# EasyEDA Pro project LisaFPGA Rev 2 EasyEDA Project.epro, schematic LisaFPGA Schematic, sheets 6 to 7 of 8

## Sheets
6 Audio/Video: Create Date: 2025-10-28; Page Name: Audio/Video; Update Date: 2026-01-07
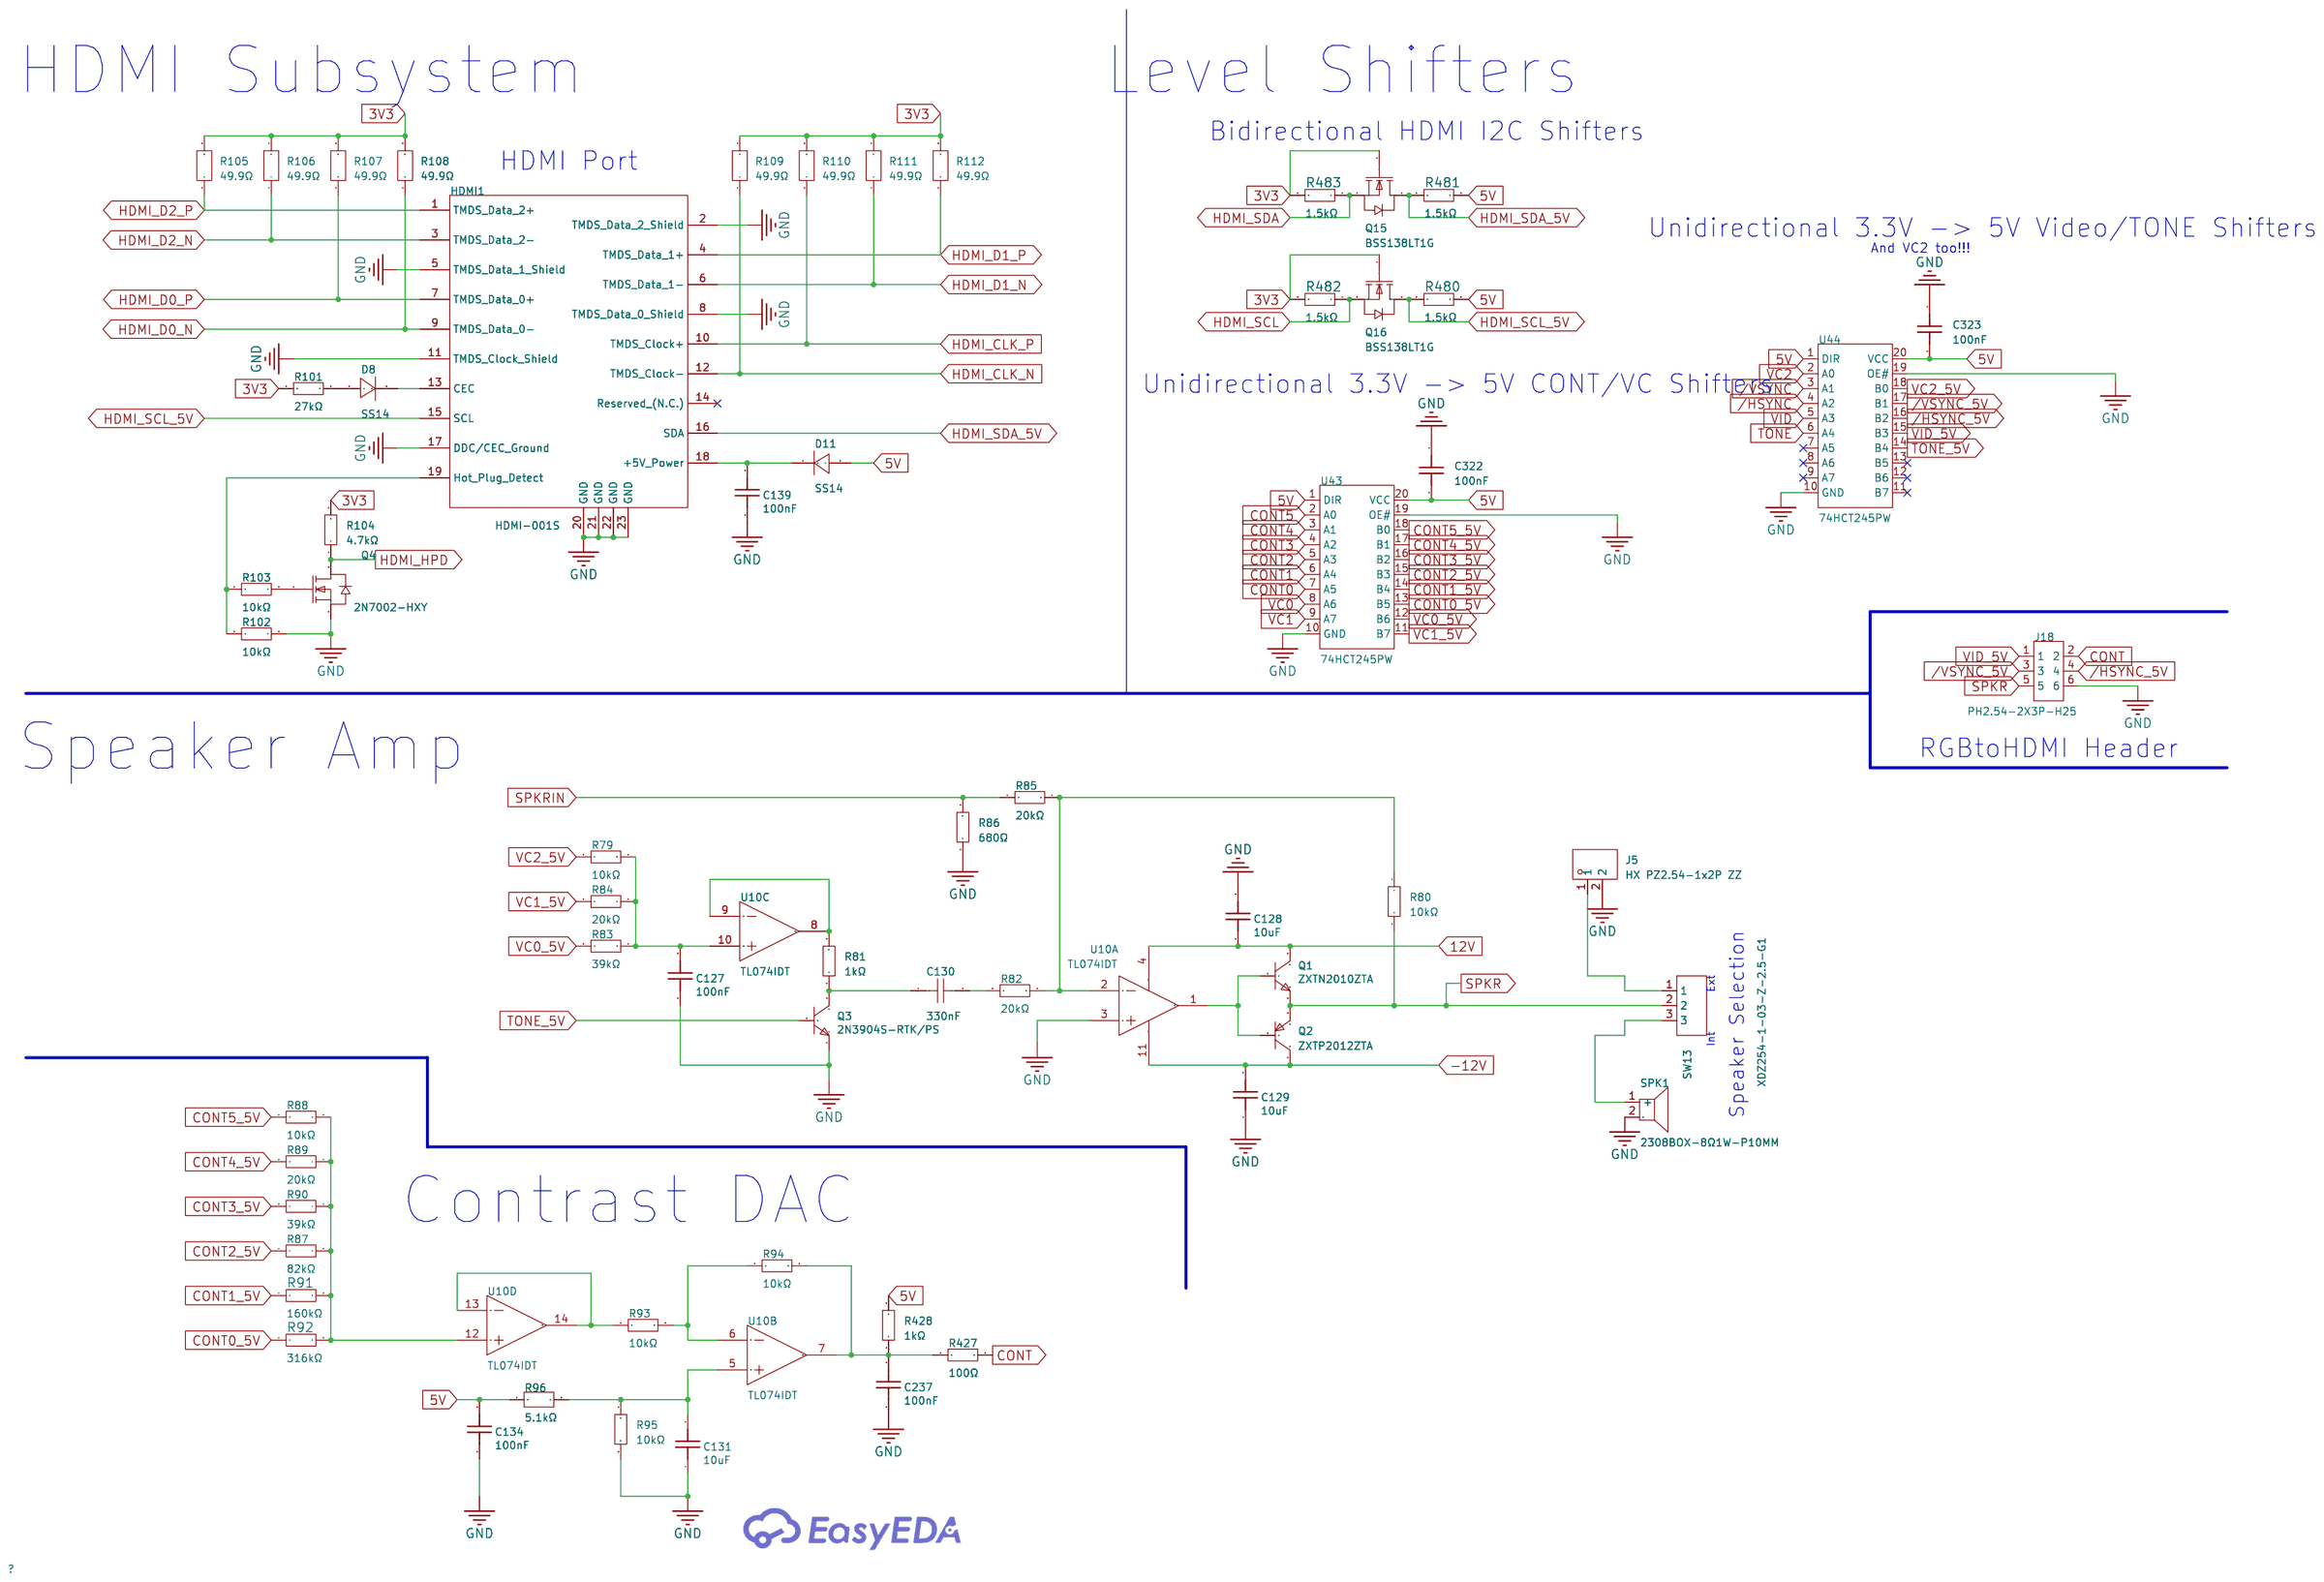
[diagram p6: Audio/Video]
7 Misc. I/O: Create Date: 2025-10-28; Page Name: Misc. I/O; Update Date: 2026-02-01
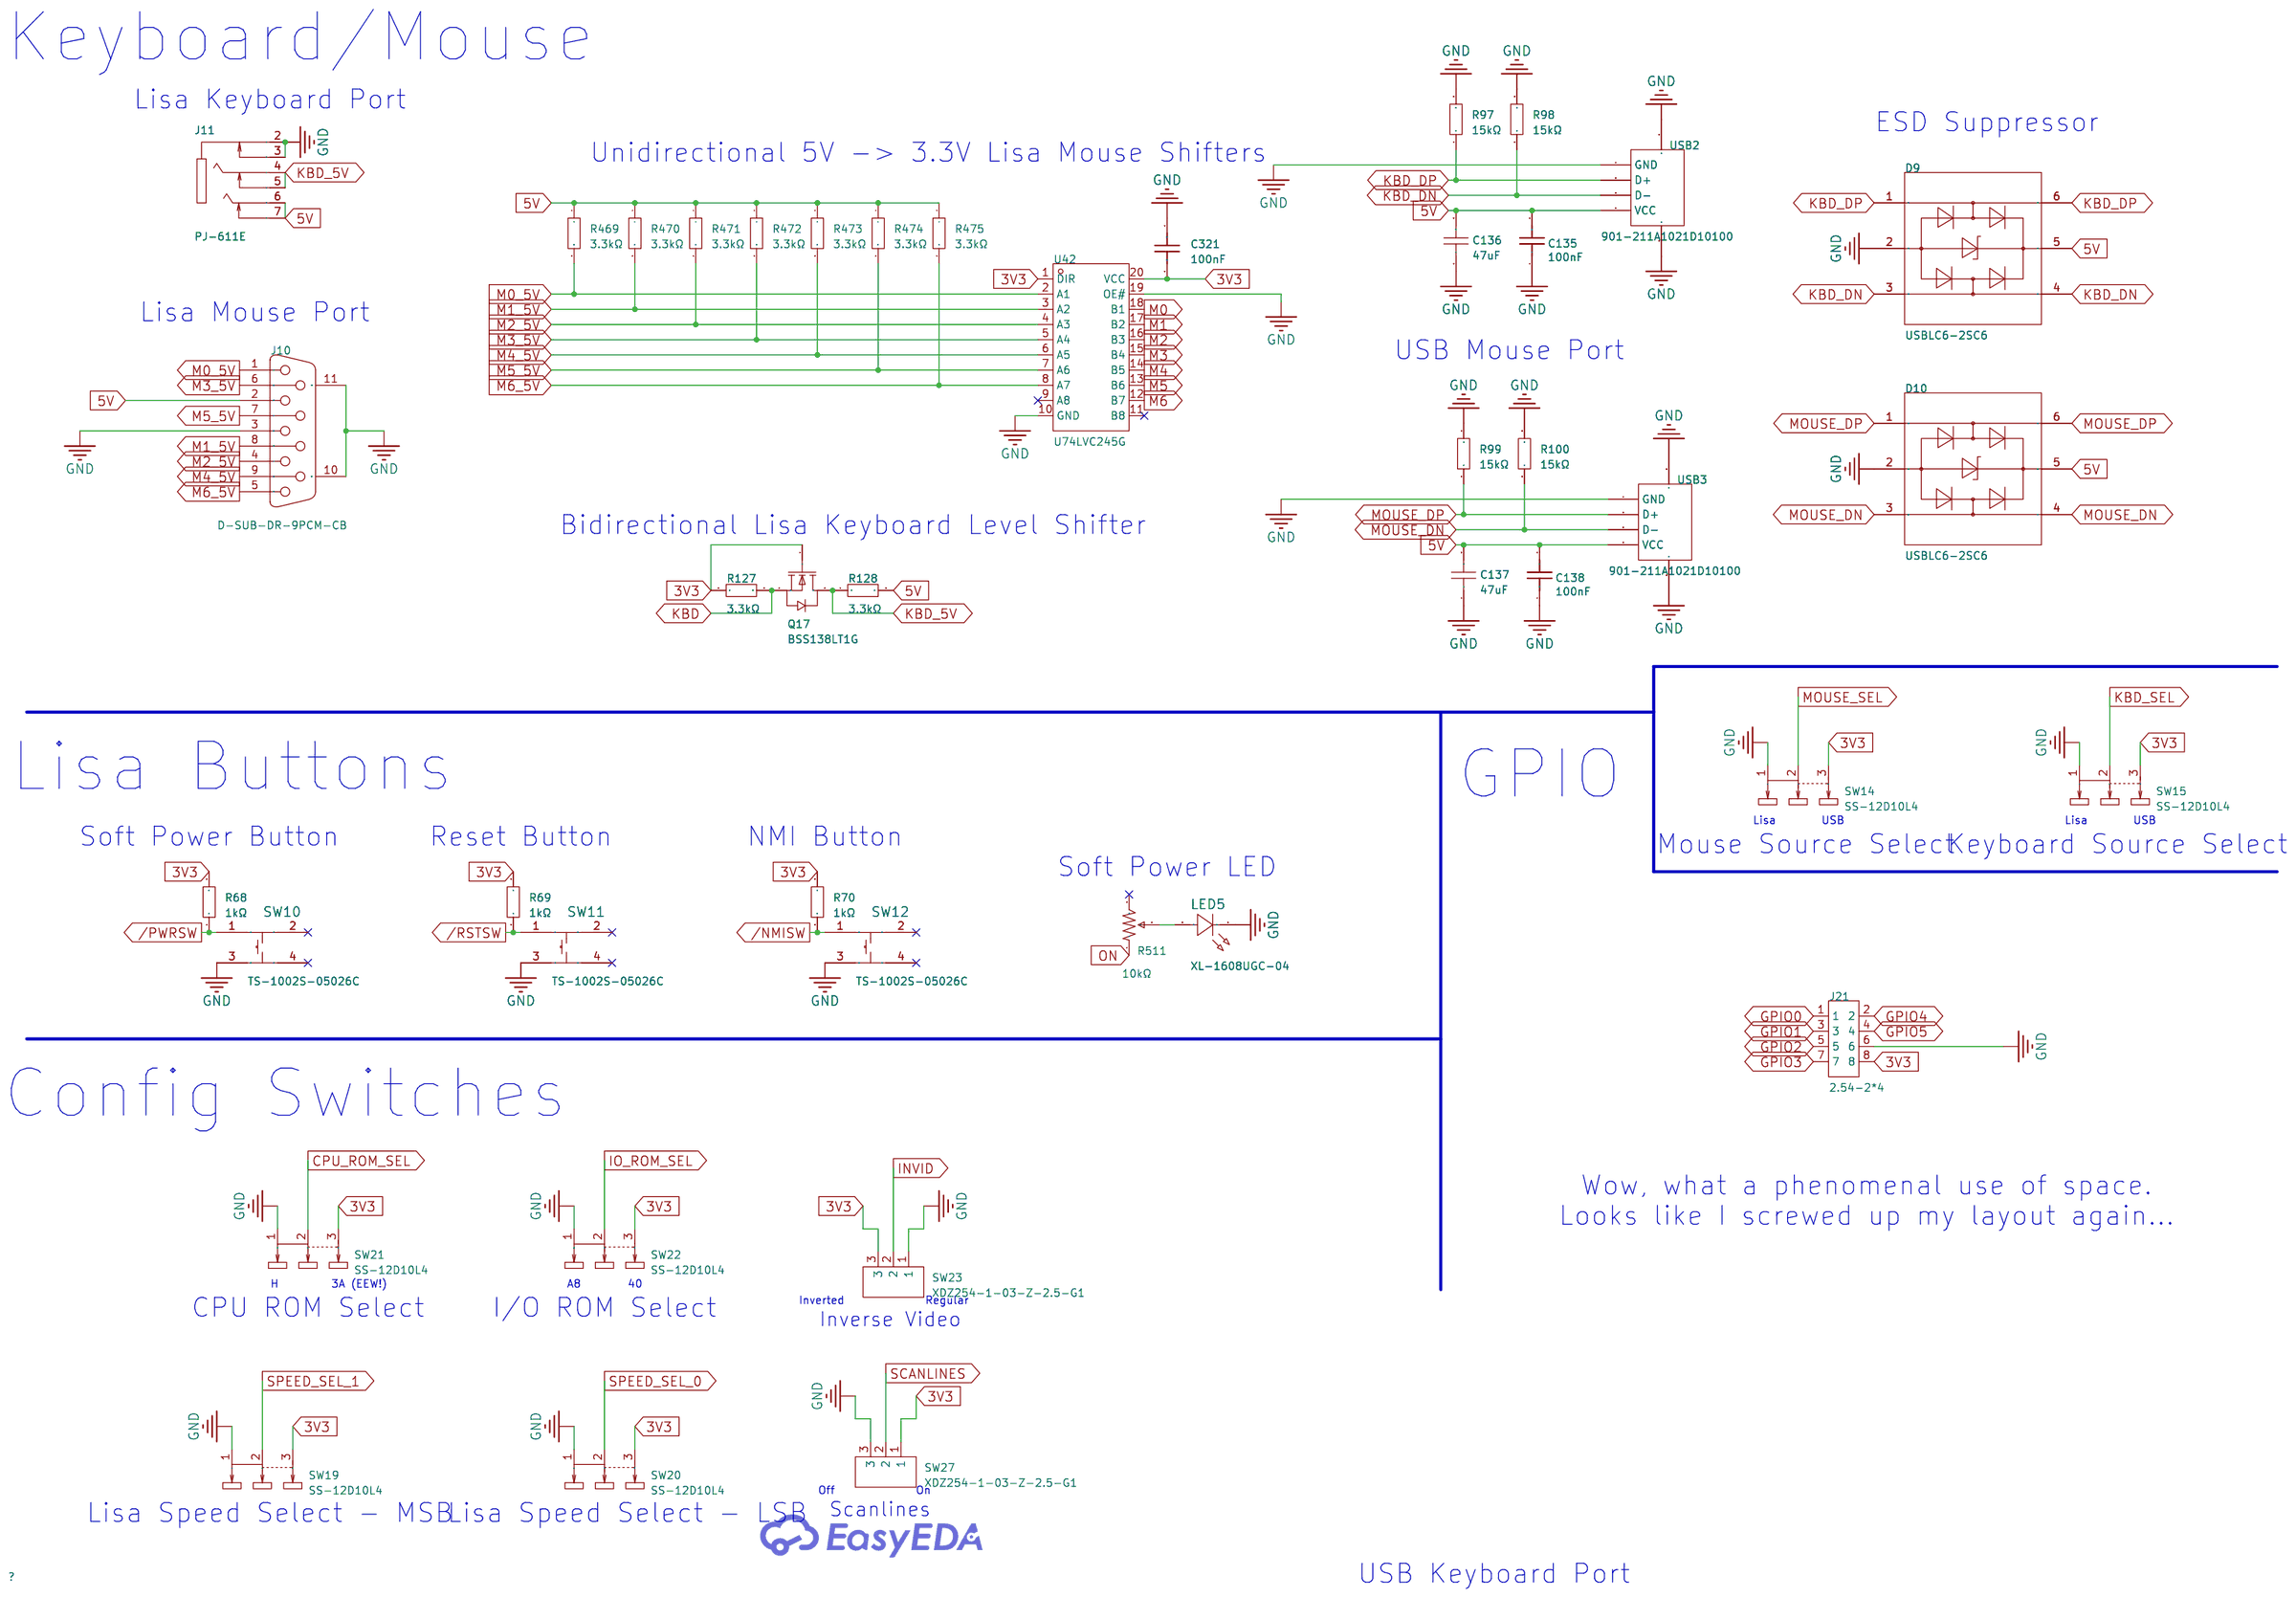
[diagram p7: Misc. I/O]

## Parts
sheet Audio/Video
C127  100nF  [C0402]
C128  10uF  [C0603]
C129  10uF  [C0603]
C130  330nF  [C0402]
C131  10uF  [C0603]
C134  100nF  [C0402]
C139  100nF  [C0402]
C237  100nF  [C0402]
C322  100nF  [C0402]
C323  100nF  [C0402]
D8  SS14  [SMA_L4.3-W2.6-LS5.0-RD]
D11  SS14  [SMA_L4.3-W2.6-LS5.0-RD]
HDMI1  HDMI-001S  [HDMI-SMD_HDMI-001S]
J5  HX PZ2.54-1x2P ZZ  [HDR-TH_2P-P2.54-V-M-3]
J18  PH2.54-2X3P-H25  [HDR-TH_6P-P2.54-V-M-R2-C3-S2.54-1]
Q1  ZXTN2010ZTA  [SOT-89-3_L4.5-W2.5-P1.50-LS4.2-TR]
Q2  ZXTP2012ZTA  [SOT-89-3_L4.5-W2.5-P1.50-LS4.2-TR]
Q3  2N3904S-RTK/PS  [SOT-23-3_L2.9-W1.3-P1.90-LS2.4-TR]
Q4  2N7002-HXY  [SOT-23-3_L2.9-W1.3-P1.90-LS2.4-BR]
Q15  BSS138LT1G  [SOT-23-3_L2.9-W1.6-P1.90-LS2.8-BR]
Q16  BSS138LT1G  [SOT-23-3_L2.9-W1.6-P1.90-LS2.8-BR]
R79  10kΩ  [R0402]
R80  10kΩ  [R0402]
R81  1kΩ  [R0402]
R82  20kΩ  [R0402]
R83  39kΩ  [R0402]
R84  20kΩ  [R0402]
R85  20kΩ  [R0402]
R86  680Ω  [R0402]
R87  82kΩ  [R0402]
R88  10kΩ  [R0402]
R89  20kΩ  [R0402]
R90  39kΩ  [R0402]
R91  160kΩ  [R0402]
R92  316kΩ  [R0402]
R93  10kΩ  [R0402]
R94  10kΩ  [R0402]
R95  10kΩ  [R0402]
R96  5.1kΩ  [R0603]
R101  27kΩ  [R0402]
R102  10kΩ  [R0402]
R103  10kΩ  [R0402]
R104  4.7kΩ  [R0402]
R105  49.9Ω  [R0402]
R106  49.9Ω  [R0402]
R107  49.9Ω  [R0402]
R108  49.9Ω  [R0402]
R109  49.9Ω  [R0402]
R110  49.9Ω  [R0402]
R111  49.9Ω  [R0402]
R112  49.9Ω  [R0402]
R427  100Ω  [R0402]
R428  1kΩ  [R0402]
R480  1.5kΩ  [R0402]
R481  1.5kΩ  [R0402]
R482  1.5kΩ  [R0402]
R483  1.5kΩ  [R0402]
SPK1  2308BOX-8Ω1W-P10MM  [BUZ-TH_BD23.0-P10.0-D0.0.8-FD]
SW13  XDZ254-1-03-Z-2.5-G1  [HDR-TH_3P-P2.54-V-M-1]
U10  TL074IDT  [SOIC-14_L8.7-W3.9-P1.27-LS6.0-BL]  (sections 1,2,3,4)
U43  74HCT245PW  [TSSOP-20_L6.5-W4.4-P0.65-LS6.4-BL]
U44  74HCT245PW  [TSSOP-20_L6.5-W4.4-P0.65-LS6.4-BL]
sheet Misc. I/O
C135  100nF  [C0402]
C136  47uF  [C1210]
C137  47uF  [C1210]
C138  100nF  [C0402]
C321  100nF  [C0402]
D9  USBLC6-2SC6  [SOT-23-6_L2.9-W1.6-P0.95-LS2.8-BL]
D10  USBLC6-2SC6  [SOT-23-6_L2.9-W1.6-P0.95-LS2.8-BL]
J10  D-SUB-DR-9PCM-CB  [DB9-TH_D-SUB-DR-9PCM-CB]
J11  PJ-611E  [AUDIO-TH_PJ-611E]
J21  2.54-2*4  [HDR-TH_8P-P2.54-V-F-R2-C4-S2.54]
LED5  XL-1608UGC-04  [LED0603-RD_GREEN]
Q17  BSS138LT1G  [SOT-23-3_L2.9-W1.6-P1.90-LS2.8-BR]
R68  1kΩ  [R0402]
R69  1kΩ  [R0402]
R70  1kΩ  [R0402]
R97  15kΩ  [R0402]
R98  15kΩ  [R0402]
R99  15kΩ  [R0402]
R100  15kΩ  [R0402]
R127  3.3kΩ  [R0402]
R128  3.3kΩ  [R0402]
R469  3.3kΩ  [R0402]
R470  3.3kΩ  [R0402]
R471  3.3kΩ  [R0402]
R472  3.3kΩ  [R0402]
R473  3.3kΩ  [R0402]
R474  3.3kΩ  [R0402]
R475  3.3kΩ  [R0402]
R511  10kΩ  [RES-ADJ-SMD_3P-L3.0-W3.8-P1.75-BR]
SW10  TS-1002S-05026C  [KEY-SMD_4P-L6.0-W6.0-P4.50-LS9.0]
SW11  TS-1002S-05026C  [KEY-SMD_4P-L6.0-W6.0-P4.50-LS9.0]
SW12  TS-1002S-05026C  [KEY-SMD_4P-L6.0-W6.0-P4.50-LS9.0]
SW14  SS-12D10L4  [SW-TH_SS-12D10L3]
SW15  SS-12D10L4  [SW-TH_SS-12D10L3]
SW19  SS-12D10L4  [SW-TH_SS-12D10L3]
SW20  SS-12D10L4  [SW-TH_SS-12D10L3]
SW21  SS-12D10L4  [SW-TH_SS-12D10L3]
SW22  SS-12D10L4  [SW-TH_SS-12D10L3]
SW23  XDZ254-1-03-Z-2.5-G1  [HDR-TH_3P-P2.54-V-M-1]
SW27  XDZ254-1-03-Z-2.5-G1  [HDR-TH_3P-P2.54-V-M-1]
U42  U74LVC245G  [TSSOP-20_L6.5-W4.4-P0.65-LS6.4-BL]
USB2  901-211A1021D10100  [USB-A-TH_USB-M-1_C2346]
USB3  901-211A1021D10100  [USB-A-TH_USB-M-1_C2346]

## Library data of the parts
C127 C134 C135 C138 C139 C237 C321-C323 = 100nF: Supplier: LCSC; Supplier Part: C343042; Manufacturer: TDK; Manufacturer Part: CGA2B3X7R1H104KT0Y0F; JLCPCB Part Class: Extended Part; nameAlias: Value; Contributor: LCSC; spicePre: C; spiceSymbolName: CGA2B3X7R1H104KT0Y0F
C128 C129 C131 = 10uF: Supplier: LCSC; Supplier Part: C2936601; Manufacturer: YAGEO(国巨); Manufacturer Part: CC0603KRX5R7BB106; JLCPCB Part Class: Extended Part; nameAlias: Value; Contributor: lcsc; spicePre: C; spiceSymbolName: CC0603KRX5R7BB106
C130 = TCC0402X5R334K250AT: Capacitance:330nF Tolerance:±10% Tolerance:±10% Voltage Rating:25V Temperature Coefficient:X5R; LCSC Part Name: 330nF ±10% 25V; Supplier Part: C5448882; Manufacturer: CCTC(三环); Supplier Footprint: 0402; JLCPCB Part Class: Extended Part; Datasheet: https://item.szlcsc.com/datasheet/TCC0402X5R334K250AT/6350845.html; Supplier: LCSC; Tolerance: ±10%; Voltage Rating: 25V; Temperature Coefficient: X5R
D8 D11 = SS14_C2837270: Diode Configuration:- Voltage - Forward(Vf@If):550mV@1A Voltage - DC Reverse(Vr):40V Current - Rectified:1A Reverse Leakage Current (Ir):500uA@40V Operating Junction Temperature Range:-55℃~+125℃ Operating Junction Temperature Range:-55℃~+125℃; LCSC Part Name: 电压:40V 电流:1A; Supplier Part: C2837270; Manufacturer: JSMSEMI(杰盛微); Supplier Footprint: SMA(DO-214AC); JLCPCB Part Class: Extended Part; Datasheet: https://item.szlcsc.com/datasheet/SS14/3007842.html; Supplier: LCSC; Voltage - Forward(Vf@If): 550mV@1A; Voltage - DC Reverse(Vr): 40V; Current - Rectified: 1A; Reverse Leakage Current (Ir): 500uA@40V; Operating Junction Temperature Range: -55℃~+125℃
HDMI1 = HDMI-001S: Connector Type:HDMI-A Gender:Female Number of Pins:19P Mounting Type:Surface Mount, Right Angle Current Rating:- Voltage Rating:- Operating Temperature:- Operating Temperature:-; Supplier Part: C720616; Manufacturer: XUNPU(讯普); Supplier Footprint: SMD; JLCPCB Part Class: Extended Part; Datasheet: https://item.szlcsc.com/datasheet/HDMI-001S/763623.html; Supplier: LCSC; Connector Type: HDMI-A; Gender: Female; Number of Pins: 19P; Mounting Type: Surface Mount, Right Angle
J5 = HX PZ2.54-1x2P ZZ: Pin Structure:1x2P Pitch:2.54mm Row Spacing:- Circluar Pins/Square Pins:Pin Header Mounting Type:Through Hole Number of Rows:1 Number of Pins:2P Current Rating:3A Voltage Rating (Max):1kV Length of Mating Pin:6mm Insulation Height:2.5mm Length of End Conn; LCSC Part Name: 1x2P 间距:2.54mm 方针 直插; Supplier Part: C32713268; Manufacturer: hanxia(韩下); Supplier Footprint: 插件,P=2.54mm; JLCPCB Part Class: Extended Part; Datasheet: https://item.szlcsc.com/datasheet/HX%2520PZ2.54-1x2P%2520ZZ/34444548.html; Supplier: LCSC; Pin Structure: 1x2P; Pitch: 2.54mm; Circluar Pins/Square Pins: Pin Header; Mounting Type: Through Hole; Number of Rows: 1; Number of Pins: 2P; Current Rating: 3A; Voltage Rating (Max): 1kV; Length of Mating Pin: 6mm; Insulation Height: 2.5mm; Length of End Connection Pin: 3mm; Contact Material: Brass; Contact Plating: Gold; Operating Temperature: -40℃~+105℃; Color: Black
J18 = PH2.54-2X3P-H25: Pin Structure:2x3P Pitch:2.54mm Row Spacing:2.54mm Circluar Pins/Square Pins:Pin Header Mounting Type:Through Hole Number of Rows:2 Number of Pins:6P Current Rating:3A Voltage Rating (Max):- Length of Mating Pin:6mm Insulation Height:2.5mm Length of End C; LCSC Part Name: 2x3P 间距:2.54mm 方针 直插; Supplier Part: C42431837; Manufacturer: JXTCONN(聚兴泰); Supplier Footprint: 插件,P=2.54mm; JLCPCB Part Class: Extended Part; Datasheet: https://item.szlcsc.com/datasheet/PH2.54-2X3P-H25/44458967.html; Supplier: LCSC; Pin Structure: 2x3P; Pitch: 2.54mm; Row Spacing: 2.54mm; Circluar Pins/Square Pins: Pin Header; Mounting Type: Through Hole; Number of Rows: 2; Number of Pins: 6P; Current Rating: 3A; Length of Mating Pin: 6mm; Insulation Height: 2.5mm; Length of End Connection Pin: 3mm; Contact Material: Brass; Contact Plating: Gold; Operating Temperature: -40℃~+105℃; Color: Black
Q1 = ZXTN2010ZTA: Transistor Type: Collector Current (Ic): Collector-Emitter Breakdown Voltage (Vceo): Power Dissipation (Pd): DC Current Gain (hFE@Ic,Vce):55@5A,1V DC Current Gain (hFE@Ic,Vce):55@5A,1V Transition Frequency (fT):130MHz Collector Cut-Off Current (Icbo):50nA; LCSC Part Name: NPN 电流:5A 耐压:60V; Supplier Part: C122575; Manufacturer: DIODES(美台); Supplier Footprint: SOT-89-3; JLCPCB Part Class: Extended Part; Datasheet: https://atta.szlcsc.com/upload/public/pdf/source/20170721/C122575_1500619339552834112.pdf; Supplier: LCSC; DC Current Gain (hFE@Ic,Vce): 55@5A,1V; Transition Frequency (fT): 130MHz; Collector Cut-Off Current (Icbo): 50nA; Collector-Emitter Saturation Voltage (VCE(sat)@Ic,Ib): 65mV@1A,50mA; Operating Temperature: -55℃~+150℃
Q2 = ZXTP2012ZTA: type:PNP Current - Collector(Ic):4.3A Collector - Emitter Voltage VCEO:60V Pd - Power Dissipation:1.5W DC Current Gain:45@5A,1V DC Current Gain:45@5A,1V Transition frequency(fT):120MHz Current - Collector Cutoff:20nA Vce Saturation(VCE(sat)):65mV Operatin; LCSC Part Name: PNP 电流:4.3A 电压:60V; Supplier Part: C122574; Manufacturer: DIODES(美台); Supplier Footprint: SOT-89; JLCPCB Part Class: Extended Part; Datasheet: https://item.szlcsc.com/datasheet/ZXTP2012ZTA/123843.html; Supplier: LCSC; type: PNP; Current - Collector(Ic): 4.3A; Collector - Emitter Voltage VCEO: 60V; Pd - Power Dissipation: 1.5W; DC Current Gain: 45@5A,1V; Transition frequency(fT): 120MHz; Current - Collector Cutoff: 20nA; Vce Saturation(VCE(sat)): 65mV; Operating Temperature: -55℃~+150℃
Q3 = 2N3904S-RTK/PS_C18536: type:NPN Current - Collector(Ic):200mA Collector - Emitter Voltage VCEO:40V Pd - Power Dissipation:350mW DC Current Gain:100@10mA,1V DC Current Gain:100@10mA,1V Transition frequency(fT):300MHz Current - Collector Cutoff:- Vce Saturation(VCE(sat)):300mV Op; LCSC Part Name: NPN 电流:200mA 电压:40V; Supplier Part: C18536; Manufacturer: KEC; Supplier Footprint: SOT-23; JLCPCB Part Class: Extended Part; Datasheet: https://item.szlcsc.com/datasheet/2N3904S-RTK%252FPS/19236.html; Supplier: LCSC; type: NPN; Current - Collector(Ic): 200mA; Collector - Emitter Voltage VCEO: 40V; Pd - Power Dissipation: 350mW; DC Current Gain: 100@10mA,1V; Transition frequency(fT): 300MHz; Vce Saturation(VCE(sat)): 300mV
Q4 = 2N7002-HXY: Number:1 N-Channel Drain to Source Voltage:60V Current - Continuous Drain(Id):300mA RDS(on):2Ω@10V,0.1A Pd - Power Dissipation:350mW Gate Threshold Voltage (Vgs(th)):1.9V Gate Charge(Qg):3nC@4.5V Input Capacitance(Ciss):50pF Reverse Transfer Capacitance (; LCSC Part Name: 1个N沟道 耐压:60V 电流:0.3A; Supplier Part: C4748728; Manufacturer: HXY MOSFET(华轩阳电子); Supplier Footprint: SOT-23; JLCPCB Part Class: Extended Part; Datasheet: https://item.szlcsc.com/datasheet/2N7002-HXY/5320771.html; Supplier: LCSC; Number: 1 N-Channel; Drain to Source Voltage: 60V; Current - Continuous Drain(Id): 300mA; RDS(on): 2Ω@10V,0.1A; Pd - Power Dissipation: 350mW; Gate Threshold Voltage (Vgs(th)): 1.9V; Gate Charge(Qg): 3nC@4.5V; Input Capacitance(Ciss): 50pF; Reverse Transfer Capacitance (Crss@Vds): 4.2pF; Operating Temperature: -55℃~+150℃
Q15-Q17 = BSS138LT1G: Number:1 N-Channel Drain to Source Voltage:50V Current - Continuous Drain(Id):200mA RDS(on):5.6Ω@2.75V Pd - Power Dissipation:225mW Gate Threshold Voltage (Vgs(th)):500mV Input Capacitance(Ciss):50pF@25V Reverse Transfer Capacitance (Crss@Vds):5pF@25V Ope; LCSC Part Name: 1个N沟道 耐压:50V 电流:200mA; Supplier Part: C82045; Manufacturer: onsemi(安森美); Supplier Footprint: SOT-23; JLCPCB Part Class: Extended Part; Datasheet: https://item.szlcsc.com/datasheet/BSS138LT1G/83200.html; Supplier: LCSC; Number: 1 N-Channel; Drain to Source Voltage: 50V; Current - Continuous Drain(Id): 200mA; RDS(on): 5.6Ω@2.75V; Pd - Power Dissipation: 225mW; Gate Threshold Voltage (Vgs(th)): 500mV; Input Capacitance(Ciss): 50pF@25V; Reverse Transfer Capacitance (Crss@Vds): 5pF@25V; Operating Temperature: -55℃~+150℃
R79 R80 R88 R93-R95 R102 R103 = RC0402FR-0710KL: Type:Thick Film Resistor Resistance:10kΩ Tolerance:±1% Tolerance:±1% Power(Watts):62.5mW Voltage-Supply(Max):50V Temperature Coefficient:±100ppm/℃ Temperature Coefficient:±100ppm/℃ Operating Temperature:-55℃~+155℃ Operating Temperature:-55℃~+155℃; LCSC Part Name: 厚膜电阻 10kΩ ±1% 62.5mW; Supplier Part: C60490; Manufacturer: YAGEO(国巨); Supplier Footprint: 0402; JLCPCB Part Class: Extended Part; Datasheet: https://item.szlcsc.com/datasheet/RC0402FR-0710KL/61542.html; Supplier: LCSC; Type: Thick Film Resistor; Tolerance: ±1%; Power(Watts): 62.5mW; Voltage-Supply(Max): 50V; Temperature Coefficient: ±100ppm/℃; Operating Temperature: -55℃~+155℃
R68-R70 R81 R428 = RC0402FR-071KL: Type:Thick Film Resistors Resistance: Tolerance:±1% Tolerance:±1% Power(Watts): Overload Voltage (Max): Temperature Coefficient:±100ppm/℃ Temperature Coefficient:±100ppm/℃ Operating Temperature Range:-55℃~+155℃ Operating Temperature Range:-55℃~+155℃; LCSC Part Name: 厚膜电阻 1kΩ ±1% 62.5mW; Supplier Part: C106235; Manufacturer: YAGEO(国巨); Supplier Footprint: 0402; JLCPCB Part Class: Extended Part; Datasheet: https://atta.szlcsc.com/upload/public/pdf/source/20180927/C295883_E8D83085EA81BD7DE0B2B681138C15EE.pdf; Supplier: LCSC; Type: Thick Film Resistors; Tolerance: ±1%; Temperature Coefficient: ±100ppm/℃; Operating Temperature Range: -55℃~+155℃
R82 R84 R85 R89 = RC0402FR-0720KL: Type:Thick Film Resistor Resistance:20kΩ Tolerance:±1% Tolerance:±1% Power(Watts):62.5mW Voltage-Supply(Max):50V Temperature Coefficient:±100ppm/℃ Temperature Coefficient:±100ppm/℃ Operating Temperature:-55℃~+155℃ Operating Temperature:-55℃~+155℃; LCSC Part Name: 厚膜电阻 20kΩ ±1% 62.5mW; Supplier Part: C93942; Manufacturer: YAGEO(国巨); Supplier Footprint: 0402; JLCPCB Part Class: Extended Part; Datasheet: https://atta.szlcsc.com/upload/public/pdf/source/20250610/89E4D743C004A82A45145C7A2CC3A578.pdf; Supplier: LCSC; Type: Thick Film Resistor; Tolerance: ±1%; Power(Watts): 62.5mW; Voltage-Supply(Max): 50V; Temperature Coefficient: ±100ppm/℃; Operating Temperature: -55℃~+155℃
R83 R90 = 0402WGF3902TCE: Type:Thick Film Resistor Resistance:39kΩ Tolerance:±1% Tolerance:±1% Power(Watts):62.5mW Voltage-Supply(Max):50V Temperature Coefficient:±100ppm/℃ Temperature Coefficient:±100ppm/℃ Operating Temperature:-55℃~+155℃ Operating Temperature:-55℃~+155℃; LCSC Part Name: 39kΩ ±1% 62.5mW 厚膜电阻; Supplier Part: C25783; Manufacturer: UNI-ROYAL(厚声); Supplier Footprint: 0402; JLCPCB Part Class: Extended Part; Datasheet: https://item.szlcsc.com/datasheet/0402WGF3902TCE/26526.html; Supplier: LCSC; Type: Thick Film Resistor; Tolerance: ±1%; Power(Watts): 62.5mW; Voltage-Supply(Max): 50V; Temperature Coefficient: ±100ppm/℃; Operating Temperature: -55℃~+155℃
R86 = 0402WGF6800TCE: Type:Thick Film Resistor Resistance:680Ω Tolerance:±1% Tolerance:±1% Power(Watts):62.5mW Voltage-Supply(Max):50V Temperature Coefficient:±100ppm/℃ Temperature Coefficient:±100ppm/℃ Operating Temperature:-55℃~+155℃ Operating Temperature:-55℃~+155℃; LCSC Part Name: 680Ω ±1% 62.5mW 厚膜电阻; Supplier Part: C25130; Manufacturer: UNI-ROYAL(厚声); Supplier Footprint: 0402; JLCPCB Part Class: Extended Part; Datasheet: https://item.szlcsc.com/datasheet/0402WGF6800TCE/25873.html; Supplier: LCSC; Type: Thick Film Resistor; Tolerance: ±1%; Power(Watts): 62.5mW; Voltage-Supply(Max): 50V; Temperature Coefficient: ±100ppm/℃; Operating Temperature: -55℃~+155℃
R87 = RC0402FR-0782KL: Type:Thick Film Resistor Resistance:82kΩ Tolerance:±1% Tolerance:±1% Power(Watts):62.5mW Voltage-Supply(Max):50V Temperature Coefficient:±100ppm/℃ Temperature Coefficient:±100ppm/℃ Operating Temperature:-55℃~+155℃ Operating Temperature:-55℃~+155℃; LCSC Part Name: 厚膜电阻 82kΩ ±1% 62.5mW; Supplier Part: C137932; Manufacturer: YAGEO(国巨); Supplier Footprint: 0402; JLCPCB Part Class: Extended Part; Datasheet: https://atta.szlcsc.com/upload/public/pdf/source/20250610/89E4D743C004A82A45145C7A2CC3A578.pdf; Supplier: LCSC; Type: Thick Film Resistor; Tolerance: ±1%; Power(Watts): 62.5mW; Voltage-Supply(Max): 50V; Temperature Coefficient: ±100ppm/℃; Operating Temperature: -55℃~+155℃
R91 = 0402WGF1603TCE: Type:Thick Film Resistors Resistance:160kΩ Tolerance:±1% Tolerance:±1% Power(Watts): Overload Voltage (Max): Temperature Coefficient:±100ppm/℃ Temperature Coefficient:±100ppm/℃ Operating Temperature Range:-55℃~+155℃ Operating Temperature Range:-55℃~+155℃; LCSC Part Name: 160kΩ ±1% 62.5mW 厚膜电阻; Supplier Part: C25757; Manufacturer: UNI-ROYAL(厚声); Supplier Footprint: 0402; JLCPCB Part Class: Extended Part; Datasheet: https://atta.szlcsc.com/upload/public/pdf/source/20200306/C422600_1E6D84923E4A46A82E41ADD87F860B5C.pdf; Supplier: LCSC; Type: Thick Film Resistors; Tolerance: ±1%; Temperature Coefficient: ±100ppm/℃; Operating Temperature Range: -55℃~+155℃
R92 = 0402WGF3163TCE: Type:Thick Film Resistor Resistance:316kΩ Tolerance:±1% Tolerance:±1% Power(Watts):62.5mW Voltage-Supply(Max):50V Temperature Coefficient:±100ppm/℃ Temperature Coefficient:±100ppm/℃ Operating Temperature:-55℃~+155℃ Operating Temperature:-55℃~+155℃; LCSC Part Name: 316kΩ ±1% 62.5mW 厚膜电阻; Supplier Part: C25777; Manufacturer: UNI-ROYAL(厚声); Supplier Footprint: 0402; JLCPCB Part Class: Extended Part; Datasheet: https://item.szlcsc.com/datasheet/0402WGF3163TCE/26520.html; Supplier: LCSC; Type: Thick Film Resistor; Tolerance: ±1%; Power(Watts): 62.5mW; Voltage-Supply(Max): 50V; Temperature Coefficient: ±100ppm/℃; Operating Temperature: -55℃~+155℃
R96 = FRC0603F5101TS: Type:Thick Film Resistor Resistance:5.1kΩ Tolerance:±1% Tolerance:±1% Power(Watts):100mW Voltage-Supply(Max):75V Temperature Coefficient:±100ppm/℃ Temperature Coefficient:±100ppm/℃ Operating Temperature:-55℃~+155℃ Operating Temperature:-55℃~+155℃; LCSC Part Name: 5.1kΩ ±1% 100mW 厚膜电阻; Supplier Part: C2907044; Manufacturer: FOJAN(富捷); Supplier Footprint: 0603; JLCPCB Part Class: Extended Part; Supplier: LCSC; Type: Thick Film Resistor; Tolerance: ±1%; Power(Watts): 100mW; Voltage-Supply(Max): 75V; Temperature Coefficient: ±100ppm/℃; Operating Temperature: -55℃~+155℃
R101 = 0402WGF2702TCE: Type:Thick Film Resistor Resistance:27kΩ Tolerance:±1% Tolerance:±1% Power(Watts):62.5mW Voltage-Supply(Max):50V Temperature Coefficient:±100ppm/℃ Temperature Coefficient:±100ppm/℃ Operating Temperature:-55℃~+155℃ Operating Temperature:-55℃~+155℃; LCSC Part Name: 27kΩ ±1% 62.5mW 厚膜电阻; Supplier Part: C25771; Manufacturer: UNI-ROYAL(厚声); Supplier Footprint: 0402; JLCPCB Part Class: Extended Part; Datasheet: https://item.szlcsc.com/datasheet/0402WGF2702TCE/26514.html; Supplier: LCSC; Type: Thick Film Resistor; Tolerance: ±1%; Power(Watts): 62.5mW; Voltage-Supply(Max): 50V; Temperature Coefficient: ±100ppm/℃; Operating Temperature: -55℃~+155℃
R104 = RC0402FR-074K7L: Type:Thick Film Resistor Resistance:4.7kΩ Tolerance:±1% Tolerance:±1% Power(Watts):62.5mW Voltage-Supply(Max):50V Temperature Coefficient:±100ppm/℃ Temperature Coefficient:±100ppm/℃ Operating Temperature:-55℃~+155℃ Operating Temperature:-55℃~+155℃; LCSC Part Name: 厚膜电阻 4.7kΩ ±1% 62.5mW; Supplier Part: C105871; Manufacturer: YAGEO(国巨); Supplier Footprint: 0402; JLCPCB Part Class: Extended Part; Datasheet: https://item.szlcsc.com/datasheet/RC0402FR-074K7L/107086.html; Supplier: LCSC; Type: Thick Film Resistor; Tolerance: ±1%; Power(Watts): 62.5mW; Voltage-Supply(Max): 50V; Temperature Coefficient: ±100ppm/℃; Operating Temperature: -55℃~+155℃
R105-R112 = FRC0402F49R9TS: Type:Thick Film Resistor Resistance:49.9Ω Tolerance:±1% Tolerance:±1% Power(Watts):62.5mW Voltage-Supply(Max):50V Temperature Coefficient:±100ppm/℃ Temperature Coefficient:±100ppm/℃ Operating Temperature:-55℃~+155℃ Operating Temperature:-55℃~+155℃; LCSC Part Name: 49.9Ω ±1% 62.5mW 厚膜电阻; Supplier Part: C2933103; Manufacturer: FOJAN(富捷); Supplier Footprint: 0402; JLCPCB Part Class: Extended Part; Supplier: LCSC; Type: Thick Film Resistor; Tolerance: ±1%; Power(Watts): 62.5mW; Voltage-Supply(Max): 50V; Temperature Coefficient: ±100ppm/℃; Operating Temperature: -55℃~+155℃
R427 = RC0402FR-07100RL: Type:Thick Film Resistor Resistance:100Ω Tolerance:±1% Tolerance:±1% Power(Watts):62.5mW Voltage-Supply(Max):50V Temperature Coefficient:±100ppm/℃ Temperature Coefficient:±100ppm/℃ Operating Temperature:-55℃~+155℃ Operating Temperature:-55℃~+155℃; LCSC Part Name: 厚膜电阻 100Ω ±1% 62.5mW; Supplier Part: C106232; Manufacturer: YAGEO(国巨); Supplier Footprint: 0402; JLCPCB Part Class: Extended Part; Datasheet: https://item.szlcsc.com/datasheet/RC0402FR-07100RL/107447.html; Supplier: LCSC; Type: Thick Film Resistor; Tolerance: ±1%; Power(Watts): 62.5mW; Voltage-Supply(Max): 50V; Temperature Coefficient: ±100ppm/℃; Operating Temperature: -55℃~+155℃
R480-R483 = 0402WGF1501TCE: Type:Thick Film Resistors Resistance:1.5kΩ Tolerance:±1% Tolerance:±1% Power(Watts): Overload Voltage (Max): Temperature Coefficient:±100ppm/℃ Temperature Coefficient:±100ppm/℃ Operating Temperature Range:-55℃~+155℃ Operating Temperature Range:-55℃~+155℃; LCSC Part Name: 1.5kΩ ±1% 62.5mW 厚膜电阻; Supplier Part: C25867; Manufacturer: UNI-ROYAL(厚声); Supplier Footprint: 0402; JLCPCB Part Class: Basic Part; Datasheet: https://atta.szlcsc.com/upload/public/pdf/source/20200306/C422600_1E6D84923E4A46A82E41ADD87F860B5C.pdf; Supplier: LCSC; Type: Thick Film Resistors; Tolerance: ±1%; Temperature Coefficient: ±100ppm/℃; Operating Temperature Range: -55℃~+155℃
SPK1 = 2308BOX-8Ω1W-P10MM: Frequency Range:0Hz~20kHz Frequency Range:0Hz~20kHz Impedance:8Ω Resonant Frequency:- Total Harmonic Distortion(THD):5% Total Harmonic Distortion(THD):5% Rated Power:1W Sound Pressure Level(SPL):- Diameter(φD):23mm Height:- Operating Temperature:- Operati; LCSC Part Name: 腔体喇叭; Supplier Part: C49247024; Manufacturer: XHXDZ(兴华鑫); JLCPCB Part Class: Extended Part; Datasheet: https://item.szlcsc.com/datasheet/2308BOX-8%25CE%25A91W-P10MM/51674993.html; Supplier: LCSC; Frequency Range: 0Hz~20kHz; Impedance: 8Ω; Total Harmonic Distortion(THD): 5%; Rated Power: 1W; Diameter(φD): 23mm
SW13 SW23 SW27 = XDZ254-1-03-Z-2.5-G1: Pin Structure:1x3P Pitch:2.54mm Circluar Pins/Square Pins:Pin Header Mounting Type:Through Hole Number of Rows:1 Number of Pins:3P Current Rating:3A Length of Mating Pin:6mm Insulation Height:2.5mm Length of End Connection Pin:3mm Operating Temperature:-4; LCSC Part Name: 1x3P 间距:2.54mm 方针 直插; Supplier Part: C18905844; Manufacturer: XUNDA(讯答); Supplier Footprint: 插件,P=2.54mm; JLCPCB Part Class: Extended Part; Datasheet: https://item.szlcsc.com/datasheet/XDZ254-1-03-Z-2.5-G1/20100548.html; Supplier: LCSC; Pin Structure: 1x3P; Pitch: 2.54mm; Circluar Pins/Square Pins: Pin Header; Mounting Type: Through Hole; Number of Rows: 1; Number of Pins: 3P; Current Rating: 3A; Length of Mating Pin: 6mm; Insulation Height: 2.5mm; Length of End Connection Pin: 3mm; Operating Temperature: -40℃~+105℃; Color: Black
U10 = TL074IDT: Number of Channels:QUAD Gain Bandwidth Product:3MHz Ib - Input Bias Current:20pA Vos - Input Offset Voltage:3mV Common Mode Rejection Ratio(CMRR):86dB Slew Rate:13V/us Voltage - Supply:6V~36V Voltage - Supply:6V~36V Quiescent Current per Amplifier:1.4mA R; LCSC Part Name: 低噪声JFET四通道运算放大器; Supplier Part: C107644; Manufacturer: ST(意法半导体); Supplier Footprint: SOIC-14; JLCPCB Part Class: Extended Part; Datasheet: https://item.szlcsc.com/datasheet/TL074IDT/108863.html; Supplier: LCSC; Number of Channels: QUAD; Gain Bandwidth Product: 3MHz; Ib - Input Bias Current: 20pA; Vos - Input Offset Voltage: 3mV; Common Mode Rejection Ratio(CMRR): 86dB; Slew Rate: 13V/us; Voltage - Supply: 6V~36V; Quiescent Current per Amplifier: 1.4mA; Input Offset Voltage Drift(Vos TC): 5uV/℃
U43 U44 = 74HCT245PW: Supplier Part: C52140501; Manufacturer: MDD(辰达半导体); Supplier Footprint: TSSOP-20L; JLCPCB Part Class: Extended Part; Datasheet: https://item.szlcsc.com/datasheet/74HCT245PW/54938180.html; Supplier: LCSC
C136 C137 = CS3225X7R476K160NRL: Capacitance:47uF Tolerance:±10% Tolerance:±10% Voltage Rating:16V Temperature Coefficient:X7R; LCSC Part Name: 47uF ±10% 16V; Supplier Part: C5440143; Manufacturer: SAMWHA(三和); Supplier Footprint: 1210; JLCPCB Part Class: Extended Part; Datasheet: https://atta.szlcsc.com/upload/public/pdf/source/20241120/90C342CED6A4517481676783052A38A7.pdf; Supplier: LCSC; Tolerance: ±10%; Voltage Rating: 16V; Temperature Coefficient: X7R
D9 D10 = USBLC6-2SC6_C7519: Polarity:Unidirectional Reverse Stand-Off Voltage (Vrwm):5.25V Clamping Voltage:17V Peak Pulse Current (Ipp):5A Voltage - Breakdown:6V Reverse Leakage Current (Ir):150nA Number of Channels:2 Operating Temperature:-40℃~+125℃ Operating Temperature:-40℃~+125; LCSC Part Name: 单向ESD; Supplier Part: C7519; Manufacturer: ST(意法半导体); Supplier Footprint: SOT-23-6L; JLCPCB Part Class: Extended Part; Datasheet: https://item.szlcsc.com/datasheet/USBLC6-2SC6/7996.html; Supplier: LCSC; Polarity: Unidirectional; Reverse Stand-Off Voltage (Vrwm): 5.25V; Clamping Voltage: 17V; Peak Pulse Current (Ipp): 5A; Voltage - Breakdown: 6V; Reverse Leakage Current (Ir): 150nA; Number of Channels: 2; Operating Temperature: -40℃~+125℃; level of protection: IEC 61000-4-2; Type: ESD; Junction Capacitance: 3.5pF
J10 = D-SUB-DR-9PCM-CB: Gender:Female Number of Pins:9P Mounting Type:Right Angle Number of Rows:2 Current Rating-Signal:3A Color:Black Operating Temperature:-50℃~+105℃ Operating Temperature:-50℃~+105℃; LCSC Part Name: 母 P数:9P; Supplier Part: C19077337; Manufacturer: XUNPU(讯普); Supplier Footprint: 弯插; JLCPCB Part Class: Extended Part; Datasheet: https://item.szlcsc.com/datasheet/D-SUB-DR-9PCM-CB/20275081.html; Supplier: LCSC; Gender: Female; Number of Pins: 9P; Mounting Type: Right Angle; Number of Rows: 2; Current Rating-Signal: 3A; Color: Black; Operating Temperature: -50℃~+105℃
J11 = PJ-611E: Connector Type:6.35mm Headphone Jack Current Rating:1A Voltage Rating (Max):50V Operating Temperature:-20℃~+70℃ Operating Temperature:-20℃~+70℃; LCSC Part Name: 三件套 6.35mm耳机座; Supplier Part: C309282; Manufacturer: HOOYA(皓宇电子); Supplier Footprint: 插件; JLCPCB Part Class: Extended Part; Datasheet: https://item.szlcsc.com/datasheet/PJ-611E/292943.html; Supplier: LCSC; Connector Type: 6.35mm Headphone Jack; Current Rating: 1A; Voltage Rating (Max): 50V; Operating Temperature: -20℃~+70℃
J21 = 2.54-2*4: Holes Structure:2x4P Pitch:2.54mm Row Spacing:2.54mm Circular Hole / Square Hole:Square Hole Mounting Type:Through Hole Number of Rows:2 Number of Positions:8P Current Rating:2.5A Voltage Rating (Max):- Holes Direction:Top Insulation Height:8.5mm Operatin; LCSC Part Name: 间距:2.54mm 2x4P 直插; Supplier Part: C2977588; Manufacturer: ZHOURI(洲日); Supplier Footprint: 插件,P=2.54mm; JLCPCB Part Class: Extended Part; Datasheet: https://item.szlcsc.com/datasheet/2.54-2*4/3388940.html; Supplier: LCSC; Holes Structure: 2x4P; Pitch: 2.54mm; Row Spacing: 2.54mm; Circular Hole / Square Hole: Square Hole; Mounting Type: Through Hole; Number of Rows: 2; Number of Positions: 8P; Current Rating: 2.5A; Holes Direction: Top; Insulation Height: 8.5mm; Operating Temperature: -40℃~+105℃
LED5 = XL-1608UGC-04: Lamp Holder Type:- Illumination Color:Emerald Green Voltage - Forward(Vf):3.3V Voltage - Forward(Vf):3.3V Power(Watts):70mW Forward Current:20mA Wavelength - Dominant:515nm~535nm Wavelength - Dominant:515nm~535nm Peak Wavelength:525nm Diode Configuration:; Supplier Part: C965804; Manufacturer: XINGLIGHT(成兴光); Supplier Footprint: 0603; JLCPCB Part Class: Extended Part; Datasheet: https://item.szlcsc.com/datasheet/XL-1608UGC-04/1051413.html; Supplier: LCSC; Illumination Color: Emerald Green; Voltage - Forward(Vf): 3.3V; Power(Watts): 70mW; Forward Current: 20mA; Wavelength - Dominant: 515nm~535nm; Peak Wavelength: 525nm; Diode Configuration: Discrete Diode; Lens Color: Water Clear; Luminous Intensity: 810mcd; Viewing Angle: 120°; Mounting Style: op View Mount
R97-R100 = RC0402FR-0715KL: Type:Thick Film Resistors Resistance: Tolerance:±1% Tolerance:±1% Power(Watts): Overload Voltage (Max): Temperature Coefficient:±100ppm/℃ Temperature Coefficient:±100ppm/℃ Operating Temperature Range:-55℃~+155℃ Operating Temperature Range:-55℃~+155℃; LCSC Part Name: 厚膜电阻 15kΩ ±1% 62.5mW; Supplier Part: C114761; Manufacturer: YAGEO(国巨); Supplier Footprint: 0402; JLCPCB Part Class: Extended Part; Datasheet: https://atta.szlcsc.com/upload/public/pdf/source/20180821/C275644_0D56F95EFF785E7D9A1FEF436B37DA78.pdf; Supplier: LCSC; Type: Thick Film Resistors; Tolerance: ±1%; Temperature Coefficient: ±100ppm/℃; Operating Temperature Range: -55℃~+155℃
R127 R128 R469-R475 = RC0402FR-073K3L: Type:Thick Film Resistor Resistance:3.3kΩ Tolerance:±1% Tolerance:±1% Power(Watts):62.5mW Voltage-Supply(Max):50V Temperature Coefficient:±100ppm/℃ Temperature Coefficient:±100ppm/℃ Operating Temperature:-55℃~+155℃ Operating Temperature:-55℃~+155℃; LCSC Part Name: 厚膜电阻 3.3kΩ ±1% 62.5mW; Supplier Part: C137992; Manufacturer: YAGEO(国巨); Supplier Footprint: 0402; JLCPCB Part Class: Extended Part; Datasheet: https://item.szlcsc.com/datasheet/RC0402FR-073K3L/149308.html; Supplier: LCSC; Type: Thick Film Resistor; Tolerance: ±1%; Power(Watts): 62.5mW; Voltage-Supply(Max): 50V; Temperature Coefficient: ±100ppm/℃; Operating Temperature: -55℃~+155℃
R511 = TC33X-2-103E: Resistance:10kΩ Tolerance:±25% Tolerance:±25% Voltage Rating:- Power(Watts):150mW Temperature Coefficient:±250ppm/℃ Temperature Coefficient:±250ppm/℃ Number of Turns:; LCSC Part Name: 10kΩ ±25%; Supplier Part: C719176; Manufacturer: BOURNS; Supplier Footprint: SMD-3P,3.8x3.6mm; JLCPCB Part Class: Extended Part; Datasheet: https://item.szlcsc.com/datasheet/TC33X-2-103E/762158.html; Supplier: LCSC; Tolerance: ±25%; Power(Watts): 150mW; Temperature Coefficient: ±250ppm/℃
SW10-SW12 = TS-1002S-05026C: Circuit:SPST Actuator Style:Round Button Mounting Type:Surface Mount,Vertical Length:6mm Width:6mm Switch Height:5mm Contact Current:50mA Voltage Rating:12V With Lamp:- Life:-; LCSC Part Name: 6*6*5mm 立贴 轻触开关; Supplier Part: C455110; Manufacturer: XUNPU(讯普); Supplier Footprint: SMD-4P,6x6mm; JLCPCB Part Class: Extended Part; Datasheet: https://item.szlcsc.com/datasheet/TS-1002S-05026C/457515.html; Supplier: LCSC; Circuit: SPST; Actuator Style: Round Button; Mounting Type: Surface Mount,Vertical; Length: 6mm; Width: 6mm; Switch Height: 5mm; Contact Current: 50mA; Voltage Rating: 12V
SW14 SW15 SW19-SW22 = SS-12D10L4: Circuit:SPDT Actuator Style:Rectangular Columnar Termination Style:PC Pin Length:13mm Width:6.8mm Switch Height:6.4mm Mounting Type:Through Hole Actuator Color:Black Current Rating:3A Voltage Rating:125V Life:10,000 Cycles Operating Temperature:-40℃~+85℃; LCSC Part Name: 柄长4mm 直插双档 滑动开关; Supplier Part: C843364; Manufacturer: XKB Connection(中国星坤); Supplier Footprint: 插件,13x6.8mm; JLCPCB Part Class: Extended Part; Datasheet: https://item.szlcsc.com/datasheet/SS-12D10L4/902366.html; Supplier: LCSC; Circuit: SPDT; Actuator Style: Rectangular Columnar; Termination Style: PC Pin; Length: 13mm; Width: 6.8mm; Switch Height: 6.4mm; Mounting Type: Through Hole; Actuator Color: Black; Current Rating: 3A; Voltage Rating: 125V; Life: 10,000 Cycles; Operating Temperature: -40℃~+85℃
U42 = U74LVC245G: Supplier Part: C7494910; Manufacturer: UTC(友顺); Supplier Footprint: TSSOP-20; JLCPCB Part Class: Extended Part; Datasheet: https://item.szlcsc.com/datasheet/U74LVC245G/8557814.html; Supplier: LCSC
USB2 USB3 = 901-211A1021D10100: Connector Type:Type-A Standard:USB 2.0 Gender:Female Number of Ports:1 Number of Contacts:4P; LCSC Part Name: Type-A 母; Supplier Part: C2346; Manufacturer: 精拓金; Supplier Footprint: 插件; JLCPCB Part Class: Extended Part; Datasheet: https://atta.szlcsc.com/upload/public/pdf/source/20210226/C2346_87D4563BBE4A0CDE1166EC89E1EB7AEC.pdf; Supplier: LCSC; Connector Type: Type-A; Standard: USB 2.0; Gender: Female; Number of Ports: 1; Number of Contacts: 4P

## Nets
3V3: C321.2 J21.8 Q15.1(G) Q16.1(G) Q17.1(G) R68.2 R69.2 R70.2 R101.1 R104.2 R105.2 R106.2 R107.2 R108.2 R109.2 R110.2 R111.2 R112.2 R127.1 R482.2 R483.2 SW14.3 SW15.3 SW19.3 SW20.3 SW21.3 SW22.3 SW23.3 SW27.1 U42.1(DIR) U42.20(VCC) ; also on sheet 1 2 3 4 5 8
5V: C134.2 C135.2 C136.2 C137.2 C138.2 C322.2 C323.2 D9.5 D10.5 D11.2(A) J10.2 J11.6 J11.7 R96.1 R128.2 R428.2 R469.1 R470.1 R471.1 R472.1 R473.1 R474.1 R475.1 R480.1 R481.1 U43.1(DIR) U43.20(VCC) U44.1(DIR) U44.20(VCC) USB2.1(VCC) USB3.1(VCC) ; also on sheet 1 2 3 4 5
12V: C128.1 Q1.2 U10.4(VCC+) ; also on sheet 1 4
-12V: C129.2 Q2.2 U10.11(VCC-) ; also on sheet 1
GND: C127.1 C128.2 C129.1 C131.1 C134.1 C135.1 C136.1 C137.1 C138.1 C139.1 C237.1 C321.1 C322.1 C323.1 D9.2 D10.2 HDMI1.2(TMDS Data 2 Shield) HDMI1.5(TMDS Data 1 Shield) HDMI1.8(TMDS Data 0 Shield) HDMI1.11(TMDS Clock Shield) HDMI1.17(DDC/CEC Ground) HDMI1.20(GND) HDMI1.21(GND) HDMI1.22(GND) HDMI1.23(GND) J5.2 J10.3 J10.10(MH1) J10.11(MH2) J11.2 J11.3 J18.6 J21.6 LED5.1(K) Q3.1(E) Q4.2(S) R86.1 R95.2 R97.2 R98.2 R99.2 R100.2 R102.2 SPK1.2 SW10.3 SW11.3 SW12.3 SW14.1 SW15.1 SW19.1 SW20.1 SW21.1 SW22.1 SW23.1 SW27.3 U10.3(1IN+) U42.10(GND) U42.19(OE#) U43.10(GND) U43.19(OE#) U44.10(GND) U44.19(OE#) USB2.0 USB2.4(GND) USB3.0 USB3.4(GND) ; also on sheet 1 2 3 4 5 8
/HSYNC: U44.4(A2) ; also on sheet 8
/HSYNC_5V: J18.4 U44.16(B2)
/NMISW: R70.1 SW12.1 ; also on sheet 8
/PWRSW: R68.1 SW10.1 ; also on sheet 8
/RSTSW: R69.1 SW11.1 ; also on sheet 8
/VSYNC: U44.3(A1) ; also on sheet 8
/VSYNC_5V: J18.3 U44.17(B1)
CONT: J18.2 R427.2
CONT0: U43.7(A5) ; also on sheet 8
CONT0_5V: R92.1 U43.13(B5)
CONT1: U43.6(A4) ; also on sheet 8
CONT1_5V: R91.1 U43.14(B4)
CONT2: U43.5(A3) ; also on sheet 8
CONT2_5V: R87.1 U43.15(B3)
CONT3: U43.4(A2) ; also on sheet 8
CONT3_5V: R90.2 U43.16(B2)
CONT4: U43.3(A1) ; also on sheet 8
CONT4_5V: R89.2 U43.17(B1)
CONT5: U43.2(A0) ; also on sheet 8
CONT5_5V: R88.1 U43.18(B0)
CPU_ROM_SEL: SW21.2 ; also on sheet 8
GPIO0: J21.1 ; also on sheet 8
GPIO1: J21.3 ; also on sheet 8
GPIO2: J21.5 ; also on sheet 8
GPIO3: J21.7 ; also on sheet 8
GPIO4: J21.2 ; also on sheet 8
GPIO5: J21.4 ; also on sheet 8
HDMI_CLK_N: HDMI1.12(TMDS Clock-) R109.1 ; also on sheet 8
HDMI_CLK_P: HDMI1.10(TMDS Clock+) R110.1 ; also on sheet 8
HDMI_D0_N: HDMI1.9(TMDS Data 0-) R108.1 ; also on sheet 8
HDMI_D0_P: HDMI1.7(TMDS Data 0+) R107.1 ; also on sheet 8
HDMI_D1_N: HDMI1.6(TMDS Data 1-) R111.1 ; also on sheet 8
HDMI_D1_P: HDMI1.4(TMDS Data 1+) R112.1 ; also on sheet 8
HDMI_D2_N: HDMI1.3(TMDS Data 2-) R106.1 ; also on sheet 8
HDMI_D2_P: HDMI1.1(TMDS Data 2+) R105.1 ; also on sheet 8
HDMI_HPD: Q4.3(D) R104.1 ; also on sheet 8
HDMI_SCL: Q16.2(S) R482.1 ; also on sheet 8
HDMI_SCL_5V: HDMI1.15(SCL) Q16.3(D) R480.2
HDMI_SDA: Q15.2(S) R483.1 ; also on sheet 8
HDMI_SDA_5V: HDMI1.16(SDA) Q15.3(D) R481.2
INVID: SW23.2 ; also on sheet 8
IO_ROM_SEL: SW22.2 ; also on sheet 8
KBD: Q17.2(S) R127.2 ; also on sheet 8
KBD_5V: J11.4 J11.5 Q17.3(D) R128.1
KBD_DN: D9.3 D9.4 R98.1 USB2.2(D-) ; also on sheet 8
KBD_DP: D9.1 D9.6 R97.1 USB2.3(D+) ; also on sheet 8
KBD_SEL: SW15.2 ; also on sheet 8
M0: U42.18(B1) ; also on sheet 8
M0_5V: J10.1 R469.2 U42.2(A1)
M1: U42.17(B2) ; also on sheet 8
M1_5V: J10.8 R470.2 U42.3(A2)
M2: U42.16(B3) ; also on sheet 8
M2_5V: J10.4 R471.2 U42.4(A3)
M3: U42.15(B4) ; also on sheet 8
M3_5V: J10.6 R472.2 U42.5(A4) ; also on sheet 3
M4: U42.14(B5) ; also on sheet 8
M4_5V: J10.9 R473.2 U42.6(A5)
M5: U42.13(B6) ; also on sheet 8
M5_5V: J10.7 R474.2 U42.7(A6)
M6: U42.12(B7) ; also on sheet 8
M6_5V: J10.5 R475.2 U42.8(A7)
MOUSE_DN: D10.3 D10.4 R100.1 USB3.2(D-) ; also on sheet 8
MOUSE_DP: D10.1 D10.6 R99.1 USB3.3(D+) ; also on sheet 8
MOUSE_SEL: SW14.2 ; also on sheet 8
ON: R511.1 ; also on sheet 8
SCANLINES: SW27.2 ; also on sheet 8
SPEED_SEL_0: SW20.2 ; also on sheet 8
SPEED_SEL_1: SW19.2 ; also on sheet 8
SPKR: J18.5 Q1.3 Q2.3 R80.2 SW13.2
SPKRIN: R85.2 R86.2
TONE: U44.6(A4) ; also on sheet 8
TONE_5V: Q3.2(B) U44.14(B4)
VC0: U43.8(A6) ; also on sheet 8
VC0_5V: R83.2 U43.12(B6)
VC1: U43.9(A7) ; also on sheet 8
VC1_5V: R84.2 U43.11(B7)
VC2: U44.2(A0) ; also on sheet 8
VC2_5V: R79.1 U44.18(B0)
VID: U44.5(A3) ; also on sheet 8
VID_5V: J18.1 U44.15(B3)
$6N988: C139.2 D11.1(C) HDMI1.18(+5V Power)
$6N996: HDMI1.19(Hot Plug Detect) R102.1 R103.1
$6N998: D8.1(C) HDMI1.13(CEC)
$6N1009: D8.2(A) R101.2
$6N3329: C237.2 R94.2 R427.1 R428.1 U10.7(2OUT)
$6N3335: R93.2 R94.1 U10.6(2IN-)
$6N3337: SPK1.1(+) SW13.3
$6N3338: C131.2 R95.1 R96.2 U10.5(2IN+)
$6N3342: R93.1 U10.13(4IN-) U10.14(4OUT)
$6N3344: J5.1 SW13.1
$6N3345: R80.1 R82.1 R85.1 U10.2(1IN-)
$6N3346: R87.2 R88.2 R89.1 R90.1 R91.2 R92.2 U10.12(4IN+)
$6N3349: Q1.1 Q2.1 U10.1(1OUT)
$6N3357: C127.2 R79.2 R83.1 R84.1 U10.10(3IN+)
$6N3361: C130.2 R82.2
$6N3364: R81.2 U10.8(3OUT) U10.9(3IN-)
$6N3365: C130.1 Q3.3(C) R81.1
$6N5483: Q4.1(G) R103.2
$7N682: LED5.2(A) R511.2

Not connected (* = marked no-connect by the designer): HDMI1 14(Reserved (N.C.))*; R511 3*; SW10 2* 4*; SW11 2* 4*; SW12 2* 4*; U42 9(A8)* 11(B8)*; U44 7(A5)* 8(A6)* 9(A7)* 11(B7)* 12(B6)* 13(B5)*

## Notes on the sheets
sheet 6
- HDMI Subsystem
- Level Shifters
- Bidirectional HDMI I2C Shifters
- HDMI Port
- Unidirectional 3.3V -> 5V Video/TONE Shifters
- And VC2 too!!!
- Unidirectional 3.3V -> 5V CONT/VC Shifters
- RGBtoHDMI Header
- Speaker Amp
- Speaker Selection
- Int       Ext
- Contrast DAC
sheet 7
- Keyboard/Mouse
- Lisa Keyboard Port
- ESD Suppressor
- Unidirectional 5V -> 3.3V Lisa Mouse Shifters
- Lisa Mouse Port
- USB Mouse Port
- Bidirectional Lisa Keyboard Level Shifter
- Lisa Buttons
- GPIO
- Lisa
- USB
- Lisa
- USB
- Soft Power Button
- Reset Button
- NMI Button
- Mouse Source Select
- Keyboard Source Select
- Soft Power LED
- Config Switches
- Wow, what a phenomenal use of space.
  Looks like I screwed up my layout again...
- H
- 3A (EEW!)
- A8
- 40
- Inverted              Regular
- Inverse Video
- CPU ROM Select
- I/O ROM Select
- Off              On
- Scanlines
- Lisa Speed Select - MSB
- Lisa Speed Select - LSB
- USB Keyboard Port
